# EAGLE design arduino shield (EAGLE 7.5.0)
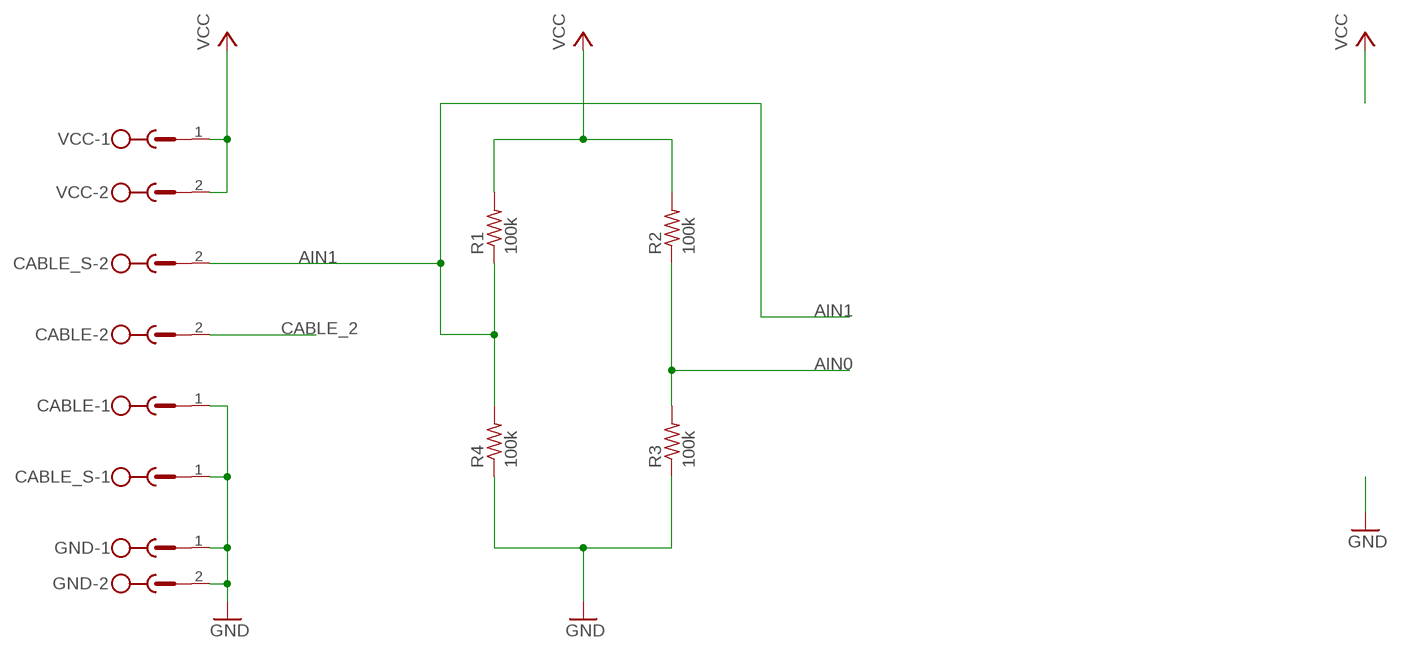
[diagram p0: schematic, sheet 1, part 1 of 2]
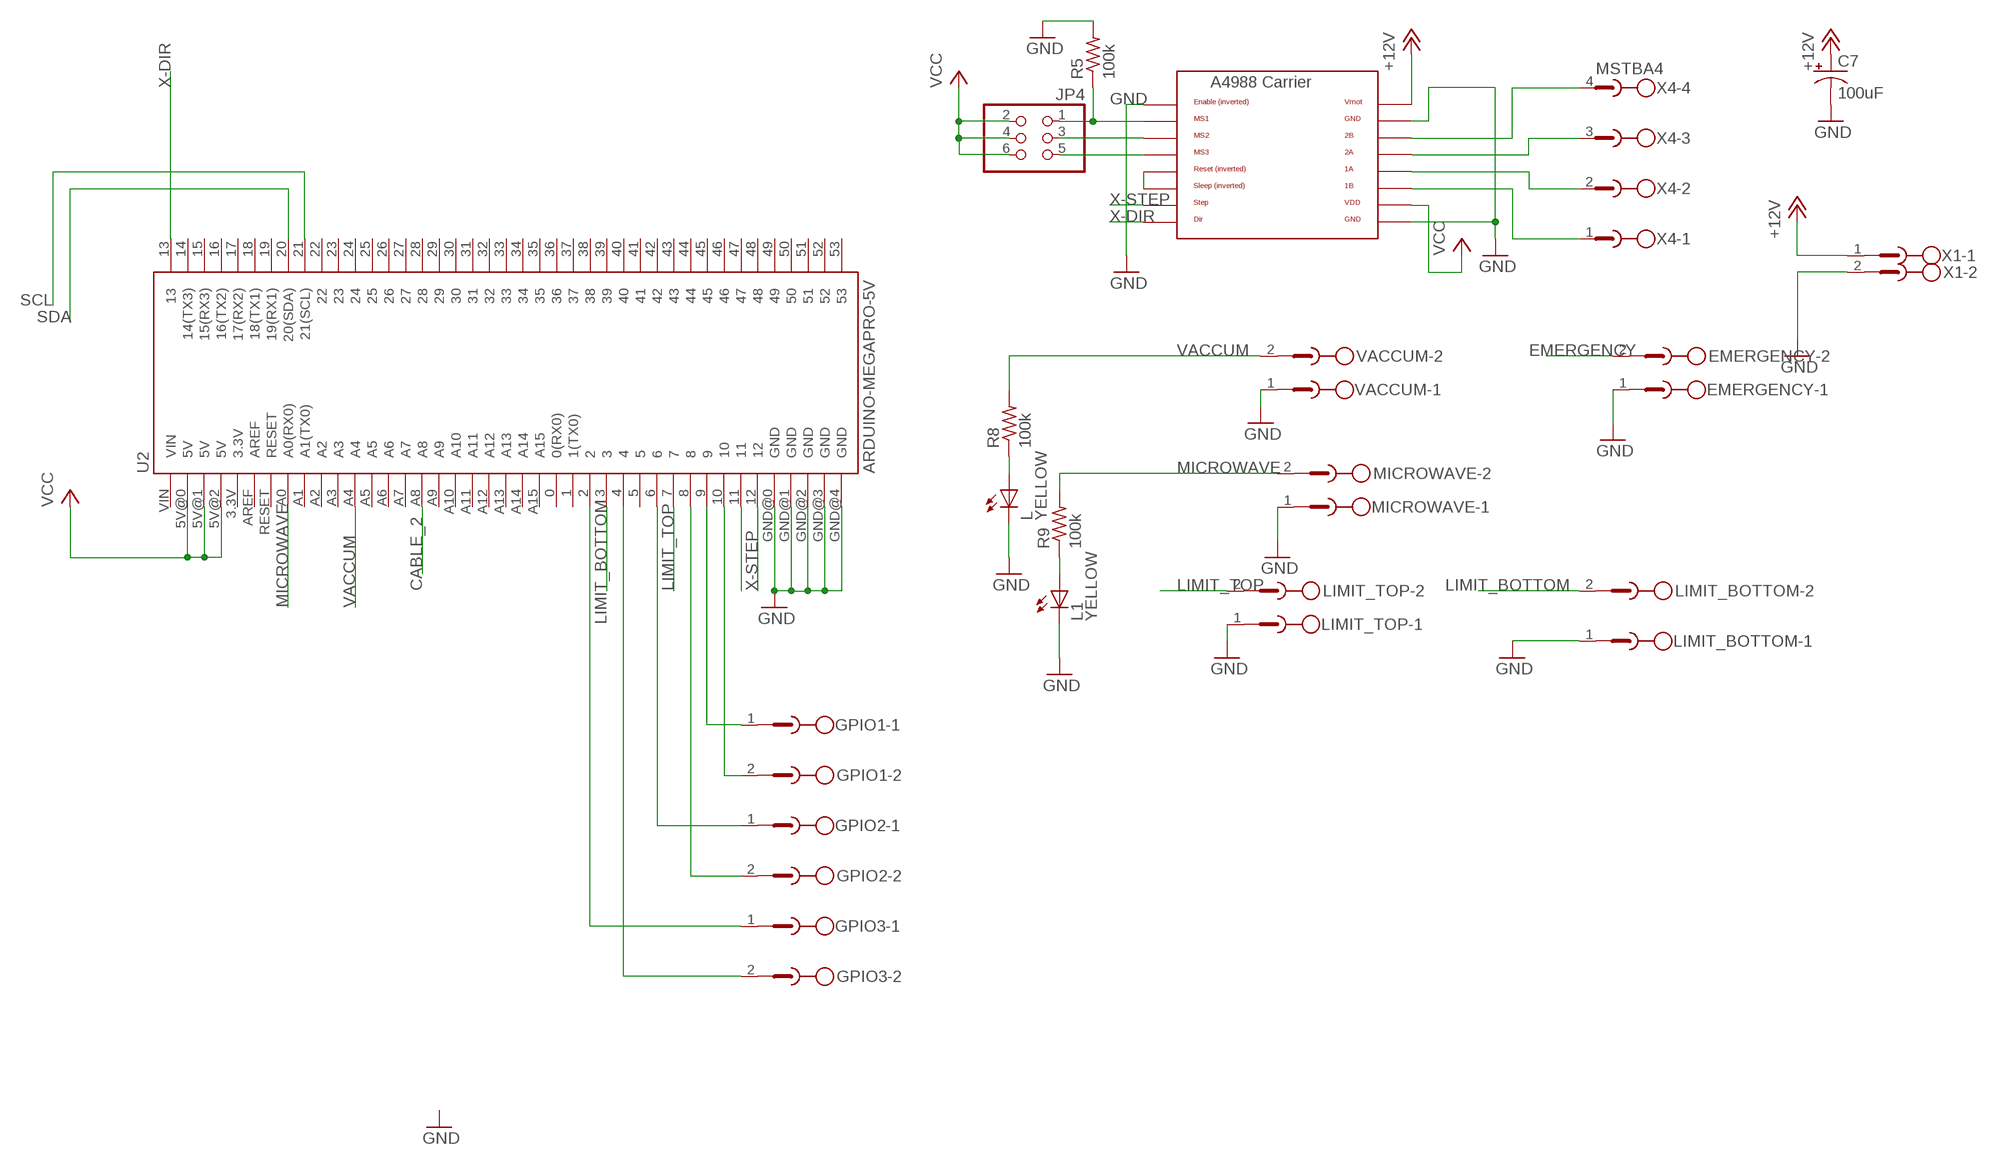
[diagram p1: schematic, sheet 1, part 2 of 2]

## Parts
C7  100uF  CPOL-US153CLV-0605  [153CLV-0605]
CABLE  MSTBV2  [MSTBV2]
CABLE_S  MSTBV2  [MSTBV2]
EMERGENCY  MSTBV2  [MSTBV2]
GND  MSTBV2  [MSTBV2]
GPIO1  MSTBV2  [MSTBV2]
GPIO2  MSTBV2  [MSTBV2]
GPIO3  MSTBV2  [MSTBV2]
JP4  PINHD-2X3  [2X03]
L  YELLOW  LEDCHIP-LED0805  [CHIP-LED0805]
L1  YELLOW  LEDCHIP-LED0805  [CHIP-LED0805]
LIMIT_BOTTOM  MSTBV2  [MSTBV2]
LIMIT_TOP  MSTBV2  [MSTBV2]
MICROWAVE  MSTBV2  [MSTBV2]
R1  100k  R-US_R0805  [R0805]
R2  100k  R-US_R0805  [R0805]
R3  100k  R-US_R0805  [R0805]
R4  100k  R-US_R0805  [R0805]
R5  100k  R-US_R0805  [R0805]
R8  100k  R-US_R0805  [R0805]
R9  100k  R-US_R0805  [R0805]
U2  ARDUINO-MEGAPRO-5V  [ARDUINO_MEGA-PRO-5V]
U$6  A4988BREAKOUT  [A4988BREAKOUT]
VACCUM  MSTBV2  [MSTBV2]
VCC  MSTBV2  [MSTBV2]
X1  MSTBV2  [MSTBV2]
X4  MSTBA4  [MSTBA4]

## Nets
+12V: C7.+ U$6.VMOT X1.1
AIN0: R2.1 R3.2
AIN1: CABLE_S.2 R1.1 R4.2
CABLE_2: CABLE.2 U2.A8
EMERGENCY: EMERGENCY.2 U2.11
GND: C7.- CABLE.1 CABLE_S.1 EMERGENCY.1 GND.1 GND.2 L1.C L.C LIMIT_BOTTOM.1 LIMIT_TOP.1 MICROWAVE.1 R3.1 R4.1 R5.2 U2.GND@0(GND) U2.GND@1(GND) U2.GND@2(GND) U2.GND@3(GND) U2.GND@4(GND) U$6.EN U$6.GND U$6.GND@0(GND) VACCUM.1 X1.2
LIMIT_BOTTOM: LIMIT_BOTTOM.2 U2.3
LIMIT_TOP: LIMIT_TOP.2 U2.7
MICROWAVE: MICROWAVE.2 R9.2 U2.A0(A0(RX0))
N$1: L.A R8.1
N$2: L1.A R9.1
N$3: GPIO1.2 U2.10
N$4: GPIO1.1 U2.9
N$5: GPIO2.2 U2.8
N$6: GPIO2.1 U2.6
N$7: GPIO3.2 U2.4
N$8: GPIO3.1 U2.2
N$14: JP4.1 R5.1 U$6.MS1
N$15: JP4.3 U$6.MS2
N$19: JP4.5 U$6.MS3
N$20: U$6.RST U$6.SLP(SLEEP)
N$21: U$6.2B X4.4
N$22: U$6.2A X4.3
N$26: U$6.1A X4.2
N$27: U$6.1B X4.1
SCL: U2.21(21(SCL))
SDA: U2.20(20(SDA))
VACCUM: R8.2 U2.A4 VACCUM.2
VCC: JP4.2 JP4.4 JP4.6 R1.2 R2.2 U2.5V@0(5V) U2.5V@1(5V) U2.5V@2(5V) U$6.VDD VCC.1 VCC.2
X-DIR: U2.13 U$6.DIR
X-STEP: U2.12 U$6.STEP
Unconnected: U2.0(0(RX0)) U2.1(1(TX0)) U2.3.3V U2.5 U2.14(14(TX3)) U2.15(15(RX3)) U2.16(16(TX2)) U2.17(17(RX2)) U2.18(18(TX1)) U2.19(19(RX1)) U2.22 U2.23 U2.24 U2.25 U2.26 U2.27 U2.28 U2.29 U2.30 U2.31 U2.32 U2.33 U2.34 U2.35 U2.36 U2.37 U2.38 U2.39 U2.40 U2.41 U2.42 U2.43 U2.44 U2.45 U2.46 U2.47 U2.48 U2.49 U2.50 U2.51 U2.52 U2.53 U2.A1(A1(TX0)) U2.A2 U2.A3 U2.A5 U2.A6 U2.A7 U2.A9 U2.A10 U2.A11 U2.A12 U2.A13 U2.A14 U2.A15 U2.AREF U2.RESET U2.VIN

## Notes on the sheet
- X

## Library data of the parts
C7 = adafruit:CPOL-US: POLARIZED CAPACITOR, American symbol
CABLE CABLE_S EMERGENCY GND GPIO1-GPIO3 LIMIT_BOTTOM LIMIT_TOP MICROWAVE VACCUM VCC X1 = con-phoenix-500:MSTBV2: PHOENIX; OC_FARNELL: unknown; OC_NEWARK: unknown
JP4 = pinhead:PINHD-2X3: PIN HEADER
L L1 = led:LED: LED OSRAM: - CHIPLED LG R971, LG N971, LY N971, LG Q971, LY Q971, LO R971, LY R971 LH N974, LH R974 LS Q976, LO Q976, LY Q976 LO Q996 - Hyper CHIPLED LW Q18S LB Q993, LB Q99A, LB R99A - SideLED LS A670, LO A670, LY A670, LG A670, LP A670 LB A673, LV A673, LT A673, LW A673 LH A674 LY A675 LS A676, LA A676, LO A676, LY A676, LW A676 LS A679, LY A679, LG A679 - Hyper Micro SIDELED® LS Y876, LA Y876, LO Y876, LY Y876 LT Y87S - SmartLED LW L88C, LW L88S LB L89C, LB L89S, LG L890 LS L89K, LO L89K, LY L89K LS L896, LA L896, LO L896, LY L896 - TOPLED LS T670, LO T670, LY T670, LG T670, LP T670 LSG T670, LSP T670, LSY T670, LOP T670, LYG T670 LG T671, LOG T671, LSG T671 LB T673, LV T673, LT T673, LW T673 LH T674 LS T676, LA T676, LO T676, LY T676, LB T676, LH T676, LSB T676, LW T676 LB T67C, LV T67C, LT T67C, LS T67K, LO T67K, LY T67K, LW E67C LS E67B, LA E67B, LO E67B, LY E67B, LB E67C, LV E67C, LT E67C LW T67C LS T679, LY T679, LG T679 LS T770, LO T770, LY T770, LG T770, LP T770 LB T773, LV T773, LT T773, LW T773 LH T774 LS E675, LA E675, LY E675, LS T675 LS T776, LA T776, LO T776, LY T776, LB T776 LHGB T686 LT T68C, LB T68C - Hyper Mini TOPLED® LB M676 - Mini TOPLED Santana® LG M470 LS M47K, LO M47K, LY M47K Source: http://www.osram.convergy.de LUXEON: - LUMILED® LXK2-PW12-R00, LXK2-PW12-S00, LXK2-PW14-U00, LXK2-PW14-V00 LXK2-PM12-R00, LXK2-PM12-S00, LXK2-PM14-U00 LXK2-PE12-Q00, LXK2-PE12-R00, LXK2-PE12-S00, LXK2-PE14-T00, LXK2-PE14-U00 LXK2-PB12-K00, LXK2-PB12-L00, LXK2-PB12-M00, LXK2-PB14-N00, LXK2-PB14-P00, LXK2-PB14-Q00 LXK2-PR12-L00, LXK2-PR12-M00, LXK2-PR14-Q00, LXK2-PR14-R00 LXK2-PD12-Q00, LXK2-PD12-R00, LXK2-PD12-S00 LXK2-PH12-R00, LXK2-PH12-S00 LXK2-PL12-P00, LXK2-PL12-Q00, LXK2-PL12-R00 Source: www.luxeon.com KINGBRIGHT: KA-3528ASYC Source: www.kingbright.com
R1-R5 R8 R9 = adafruit:R-US_: RESISTOR, American symbol
U2 = sparkfun:ARDUINO-MEGA: Arduino Mega board footprint
U$6 = RepRapjr:A4988BREAKOUT
X4 = con-phoenix-508:MSTBA4: PHOENIX

## Net classes
2 gnd: width 0.203 mm, drill 0.559 mm, clearance 0.152 mm

## Board
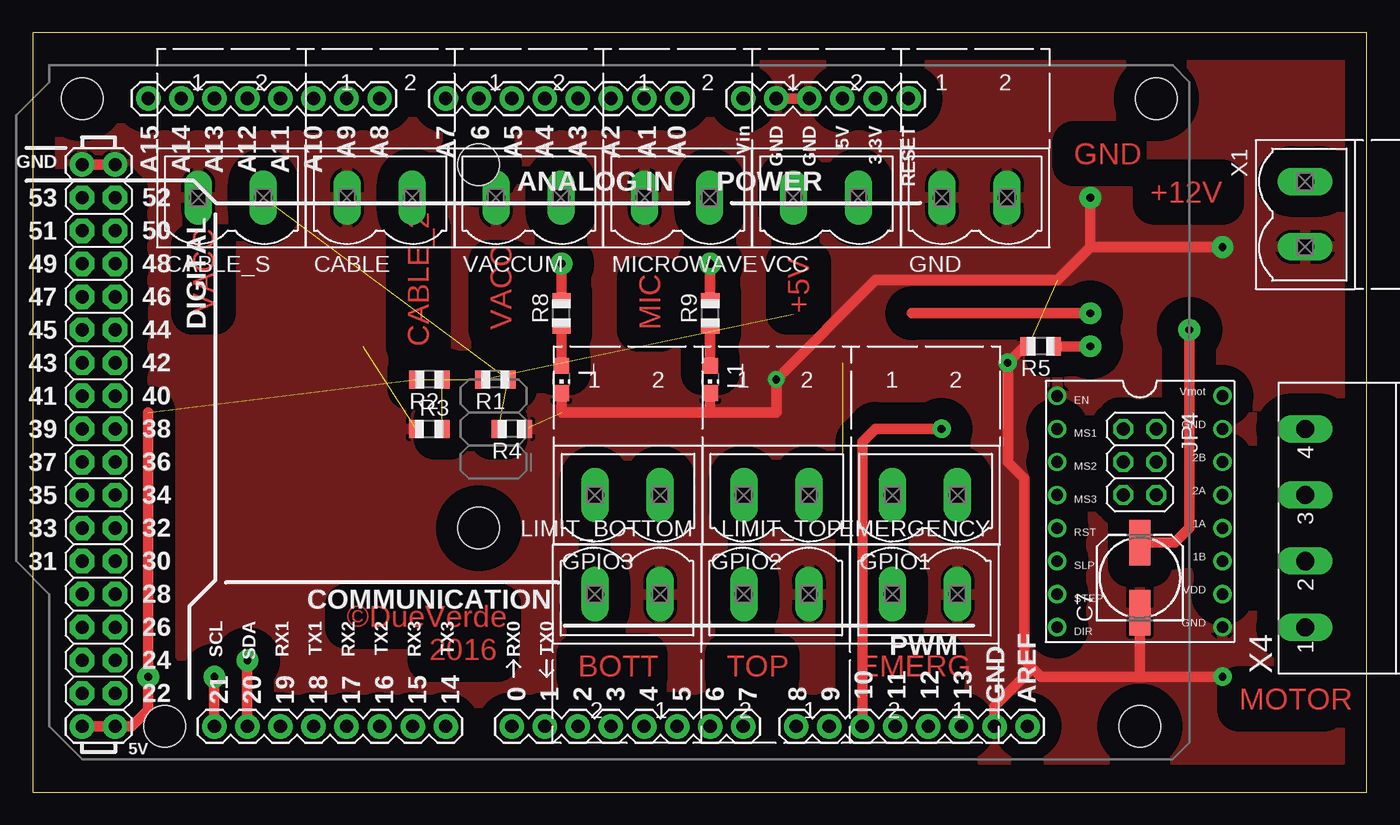
[diagram p2: board, top side]
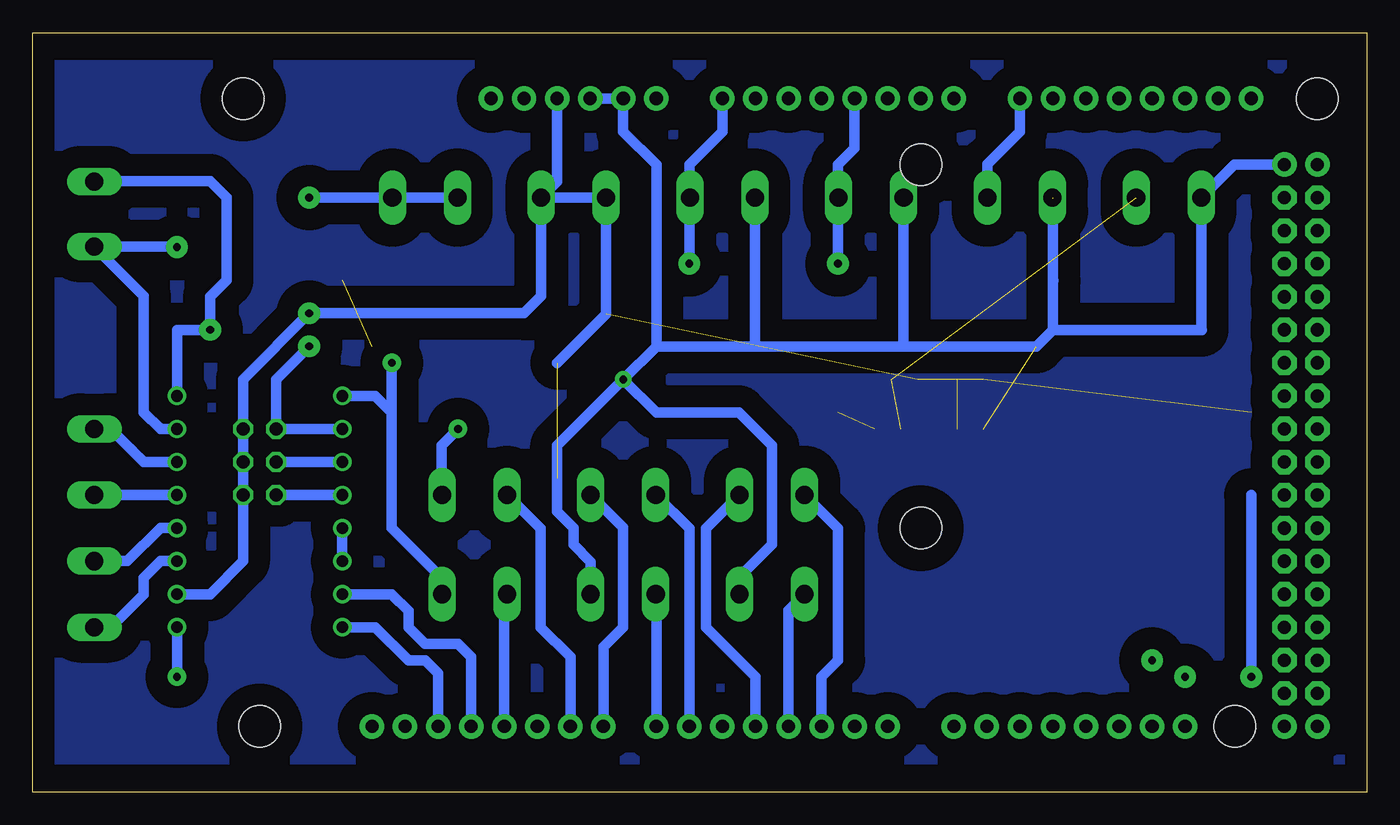
[diagram p3: board, bottom side, seen from below]

Size 102.54 x 58.41 mm. Coordinates in mm from the lower left corner, seen from the top.
Outline: 0,0 102.54,0 102.54,58.41 0,58.41 0,0
Copper layers (1*16): Top 0.035mm / dielectric 1.5mm / Bottom 0.035mm
Design rules "default": minimum track width 10mil, minimum drill 24mil, track to track 8mil, track to pad 8mil, pad to pad 8mil, via to via 8mil, smd to smd 8mil, copper to edge 40mil, drill to drill 8mil, minimum pad ring 10mil, minimum via ring 8mil, stop-mask expansion 4mil, vias tented up to drill 0mil, thermal gap 10mil

### Footprints (pad centres in the part's own frame; a part is rotated, then mirrored left to right if it is on the bottom)
153CLV-0605 = smd 3.5 x 1.6: + 2.7,0; - -2.7,0
MSTBV2 = drill 1.397 long: 1 -2.5,0; 2 2.5,0
2X03 = drill 1.016 octagon: 1 -2.54,-1.27; 2 -2.54,1.27; 3 0,-1.27; 4 0,1.27; 5 2.54,-1.27; 6 2.54,1.27
CHIP-LED0805 = smd 1.2 x 1.2: A 0,-1.05; C 0,1.05
R0805 = smd 1.1 x 1.4: 1 -1,0; 2 1,0
ARDUINO_MEGA-PRO-5V = drill 1.016 pad 1.88: 0 52.07,50.8; 1 49.53,50.8; 2 46.99,50.8; 3 44.45,50.8; 3.3V 24.13,2.54; 4 41.91,50.8; 5 39.37,50.8; 5V@0 26.67,2.54; 5V@1 82.55,50.8; 5V@2 85.09,50.8; 6 36.83,50.8; 7 34.29,50.8; 8 30.226,50.8; 9 27.686,50.8; 10 25.146,50.8; 11 22.606,50.8; 12 20.066,50.8; 13 17.526,50.8; 14 57.15,50.8; 15 59.69,50.8; 16 62.23,50.8; 17 64.77,50.8; 18 67.31,50.8; 19 69.85,50.8; 20 72.39,50.8; 21 74.93,50.8; A0 39.37,2.54; A1 41.91,2.54; A2 44.45,2.54; A3 46.99,2.54; A4 49.53,2.54; A5 52.07,2.54; A6 54.61,2.54; A7 57.15,2.54; A8 62.23,2.54; A9 64.77,2.54; A10 67.31,2.54; A11 69.85,2.54; A12 72.39,2.54; A13 74.93,2.54; A14 77.47,2.54; A15 80.01,2.54; AREF 12.446,50.8; GND@0 29.21,2.54; GND@1 31.75,2.54; GND@2 82.55,7.62; GND@3 85.09,7.62; GND@4 14.986,50.8; RESET 21.59,2.54; VIN 34.29,2.54 | drill 1.016 pad 1.88 octagon: 22 82.55,48.26; 23 85.09,48.26; 24 82.55,45.72; 25 85.09,45.72; 26 82.55,43.18; 27 85.09,43.18; 28 82.55,40.64; 29 85.09,40.64; 30 82.55,38.1; 31 85.09,38.1; 32 82.55,35.56; 33 85.09,35.56; 34 82.55,33.02; 35 85.09,33.02; 36 82.55,30.48; 37 85.09,30.48; 38 82.55,27.94; 39 85.09,27.94; 40 82.55,25.4; 41 85.09,25.4; 42 82.55,22.86; 43 85.09,22.86; 44 82.55,20.32; 45 85.09,20.32; 46 82.55,17.78; 47 85.09,17.78; 48 82.55,15.24; 49 85.09,15.24; 50 82.55,12.7; 51 85.09,12.7; 52 82.55,10.16; 53 85.09,10.16 | hole 3.2: 3.81,50.8; 2.54,2.54; 54.61,35.56; 54.61,7.62; 78.74,50.8; 85.09,2.54
A4988BREAKOUT = drill 0.9: 1A 8.89,1.27; 1B 11.43,1.27; 2A 6.35,1.27; 2B 3.81,1.27; DIR 16.51,-11.43; EN -1.27,-11.43; GND 16.51,1.27; GND@0 1.27,1.27; MS1 1.27,-11.43; MS2 3.81,-11.43; MS3 6.35,-11.43; RST 8.89,-11.43; SLP 11.43,-11.43; STEP 13.97,-11.43; VDD 13.97,1.27; VMOT -1.27,1.27
MSTBA4 = drill 1.397 long: 1 -7.62,5.08; 2 -2.54,5.08; 3 2.54,5.08; 4 7.62,5.08

### Placement (x,y rotation side)
C7  85.09,16.51 90 top
CABLE  26.67,45.72 0 top
CABLE_S  15.24,45.72 0 top
EMERGENCY  68.58,15.24 180 top
GND  72.39,45.72 0 top
GPIO1  68.58,22.86 0 top
GPIO2  57.15,22.86 0 top
GPIO3  45.72,22.86 0 top
JP4  85.09,25.4 270 top
L  40.64,31.75 180 top
L1  52.07,31.75 180 top
LIMIT_BOTTOM  45.72,15.24 180 top
LIMIT_TOP  57.15,15.24 180 top
MICROWAVE  49.53,45.72 0 top
R1  35.56,31.75 180 top
R2  30.48,31.75 180 top
R3  30.48,27.94 0 top
R4  36.83,27.94 180 top
R5  77.47,34.29 180 top
R8  40.64,36.83 90 top
R9  52.07,36.83 90 top
U2  88.9,55.88 180 top
U$6  90.17,29.21 270 top
VACCUM  38.1,45.72 0 top
VCC  60.96,45.72 0 top
X1  97.79,44.45 270 top
X4  102.87,20.32 90 top

### Tracks (layer width: path | path; a pad name or v marks a point on that pad's centre or on a via)
+12V  (via drill 0.6 pad 1.68)
  Top 0.813: C7.+ 87.79,19.21 88.9,20.32 v88.9,35.56
  Bottom 0.813: U$6.VMOT 91.44,35.56 v88.9,35.56 88.9,38.1 87.63,39.37 87.63,45.72 88.9,46.99 97.75,46.99 X1.1
AIN0  (1 unrouted)
AIN1  (2 unrouted)
CABLE_2
  Bottom 0.813: CABLE.2 29.17,48.3 26.67,50.8 U2.A8
EMERGENCY
  Bottom 0.813: U2.11 66.29,15.03 EMERGENCY.2
GND  (via drill 0.6 pad 1.27, 0.6 pad 1.42, 0.6 pad 1.68)  (4 unrouted)
  Top 0.813: U2.GND@3 U2.GND@2 | U2.GND@1 U2.GND@0 | L.C 40.64,29.21 52.07,29.21 | 52.07,29.21 L1.C | 52.07,29.21 57.15,29.21 v57.15,31.75 64.77,39.37 78.74,39.37 81.28,41.91 | v81.28,45.72 81.28,41.91 | v91.44,41.91 81.28,41.91 | R5.2 76.2,34.29 v74.93,33.02 74.93,25.4 76.2,24.13 76.2,10.16 76.83,9.53 | v91.44,8.89 85.09,8.89 | 85.09,8.89 77.47,8.89 76.83,9.53 | U2.GND@4 73.91,6.6 76.83,9.53 | C7.- 85.09,8.89
  Bottom 0.813: U$6.GND@0 92.71,27.94 93.98,29.21 93.98,38.14 X1.2 91.48,41.95 v91.44,41.91 | U2.GND@0 U2.GND@1 57.15,50.8 54.61,48.26 54.61,34.29 | MICROWAVE.1 47.03,34.33 46.99,34.29 | 46.99,34.29 54.61,34.29 | VACCUM.1 35.6,34.33 35.56,34.29 | 35.56,34.29 46.99,34.29 | 24.13,45.68 24.13,39.37 | 24.13,39.37 24.13,35.56 | 24.13,35.56 25.4,34.29 35.56,34.29 | U2.GND@2 10.2,48.26 CABLE_S.1 12.74,35.6 12.7,35.56 24.13,35.56 | 24.09,39.33 24.13,39.37 | 54.61,34.29 v57.15,31.75 | GND.1 GND.2 v81.28,45.72 | EMERGENCY.1 71.08,16.47 74.93,20.32 74.93,29.21 | 74.93,29.21 76.2,30.48 U$6.EN | v74.93,33.02 74.93,29.21 | U$6.GND v91.44,8.89 | LIMIT_TOP.1 59.65,17.74 60.96,19.05 60.96,20.32 62.23,21.59 62.23,26.67 v57.15,31.75 | LIMIT_BOTTOM.1 48.22,16.55 45.72,19.05 45.72,26.67 48.26,29.21 54.61,29.21 v57.15,31.75
  pour Top (isolate 1.676): 1.27,2.54 101.6,2.54 101.6,55.88 1.27,55.88
LIMIT_BOTTOM
  Bottom 0.813: U2.3 44.45,14.01 LIMIT_BOTTOM.2
LIMIT_TOP
  Bottom 0.813: U2.7 54.61,15.2 LIMIT_TOP.2
MICROWAVE  (via drill 0.6 pad 1.68)
  Top 0.813: R9.2 v52.07,40.64
  Bottom 0.813: v52.07,40.64 52.07,45.68 MICROWAVE.2 52.07,45.76 52.07,48.26 49.53,50.8 U2.A0
N$1
  Top 0.813: R8.1 L.A
N$2
  Top 0.813: R9.1 L1.A
N$3  (via drill 0.6 pad 1.42)
  Top 0.813: U2.10 63.75,26.92 64.77,27.94 v69.85,27.94
  Bottom 0.813: v69.85,27.94 71.12,26.67 71.12,22.9 GPIO1.2
N$4
  Bottom 0.813: U2.9 61.21,10.41 63.5,12.7 63.5,20.28 GPIO1.1
N$5
  Bottom 0.813: U2.8 58.67,11.18 57.15,12.7 57.15,20.36 GPIO2.2
N$6
  Bottom 0.813: U2.6 52.07,20.28 GPIO2.1
N$7
  Bottom 0.813: U2.4 46.99,8.89 50.8,12.7 50.8,20.28 GPIO3.2
N$8
  Bottom 0.813: U2.2 41.91,8.89 40.64,10.16 40.64,20.28 GPIO3.1
N$14  (via drill 0.6 pad 1.68)
  Top 0.813: R5.1 v81.28,34.29
  Bottom 0.813: U$6.MS1 JP4.1 83.82,31.75 v81.28,34.29
N$15
  Bottom 0.813: U$6.MS2 JP4.3
N$19
  Bottom 0.813: U$6.MS3 JP4.5
N$20
  Bottom 0.813: U$6.RST U$6.SLP
N$21
  Bottom 0.813: X4.4 96.52,27.94 93.98,25.4 U$6.2B
N$22
  Bottom 0.813: X4.3 U$6.2A
N$26
  Bottom 0.813: X4.2 95.25,17.78 92.71,20.32 U$6.1A
N$27
  Bottom 0.813: X4.1 96.52,12.7 93.98,15.24 93.98,16.51 92.71,17.78 U$6.1B
NAME
  pour Bottom (isolate 1.676): 1.27,2.54 101.6,2.54 101.6,55.88 1.27,55.88
SCL  (via drill 0.6 pad 1.68)
  Top 0.813: U2.21 v13.97,8.89
SDA  (via drill 0.6 pad 1.68)
  Top 0.813: U2.20 v16.51,10.16
VACCUM  (via drill 0.6 pad 1.68)
  Top 0.813: R8.2 v40.64,40.64
  Bottom 0.813: v40.64,40.64 40.64,45.68 VACCUM.2 40.64,45.76 40.64,48.26 39.37,49.53 U2.A4
VCC  (via drill 0.6 pad 1.68)  (4 unrouted)
  Top 0.813: U2.5V@2 U2.5V@1 7.62,5.08 8.89,6.35 v8.89,8.89 8.89,29.21 | v81.28,36.83 67.58,36.83
  Bottom 0.813: U$6.VDD 88.9,15.24 86.36,17.78 JP4.6 JP4.4 JP4.2 86.36,31.75 v81.28,36.83 64.77,36.83 63.46,38.14 VCC.2 | U2.5V@0 62.23,46.95 VCC.2 | VCC.2 VCC.1 58.46,36.79 62.23,33.02 | 8.89,22.86 v8.89,8.89
X-DIR
  Bottom 0.813: U2.13 71.37,9.14 72.39,10.16 73.66,10.16 76.2,12.7 U$6.DIR
X-STEP
  Bottom 0.813: U2.12 68.83,10.41 69.85,11.43 72.39,11.43 73.66,12.7 73.66,13.97 74.93,15.24 U$6.STEP

### Text on the board
Top: GND | +12V | VACC | +5V | VACC | MIC | CABLE_2 | ©DueVerde | 2016 | BOTT | TOP | EMERG | MOTOR